# EAGLE design Final_MG (EAGLE 9.3.2)
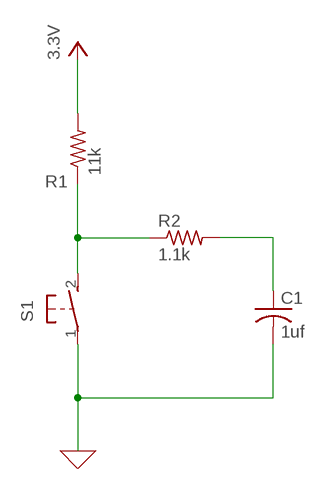
[diagram p0: schematic, sheet 1]

## Parts
C1  1uf  C-US025-024X044  [C025-024X044]
R1  11k  R-US_0204/2V  [0204V]
R2  1.1k  R-US_0204/2V  [0204V]
S1  31-XX  [B3F-31XX]

## Nets
0: C1.2 S1.1(P) ; supply symbol labelled GND
N$1: C1.1 R2.2
N$2: R1.1 R2.1 S1.2(S)
VCC: R1.2 ; supply symbol labelled 3.3V

## Library data of the parts
C1 = rcl:C-US: CAPACITOR, American symbol; SPICEPREFIX: C
R1 R2 = rcl:R-US_: RESISTOR, American symbol; SPICEPREFIX: R
S1 = switch-omron:31-XX: OMRON SWITCH; MPN: B3F-3100; OC_FARNELL: 959704; OC_NEWARK: 36M3582

## Board
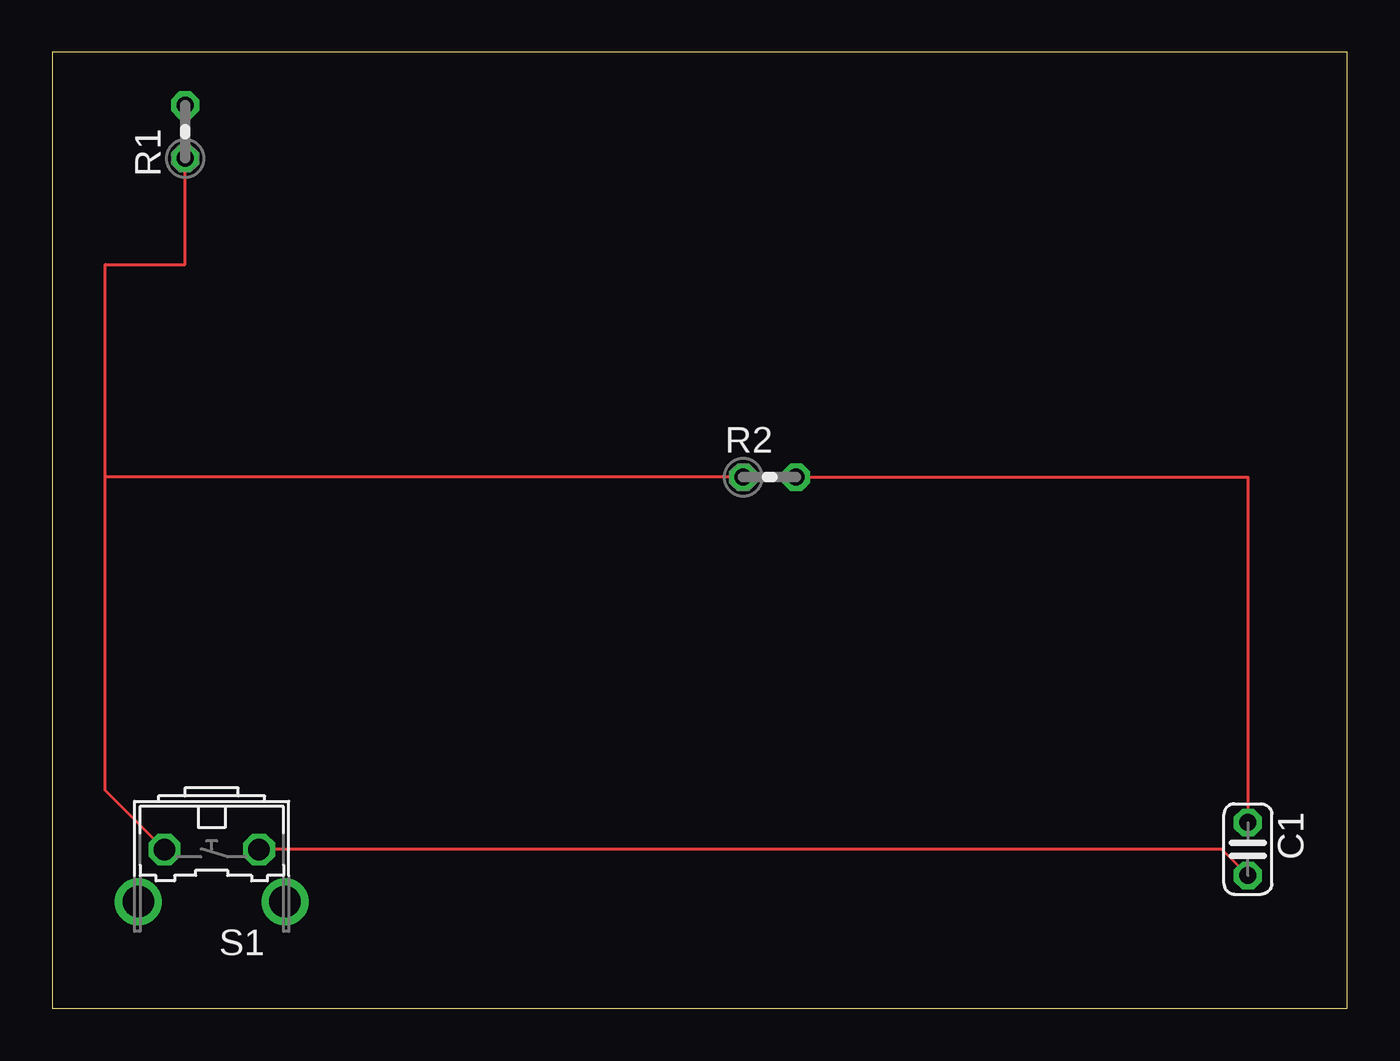
[diagram p1: board, top side]

Size 61.9 x 45.71 mm. Coordinates in mm from the lower left corner, seen from the top.
Outline: 0,0 61.9,0 61.9,45.71 0,45.71 0,0
Copper layers (1*16): Top 0.035mm / dielectric 1.5mm / Bottom 0.035mm
Design rules "default": minimum track width 6mil, minimum drill 0.35mm, track to track 6mil, track to pad 6mil, pad to pad 6mil, via to via 6mil, smd to smd 6mil, copper to edge 40mil, drill to drill 6mil, minimum pad ring 10mil, minimum via ring 8mil, stop-mask expansion 4mil, vias tented up to drill 0mil, thermal gap 10mil

### Footprints (pad centres in the part's own frame; a part is rotated, then mirrored left to right if it is on the bottom)
C025-024X044 = drill 0.813 octagon: 1 -1.27,0; 2 1.27,0
0204V = drill 0.813 octagon: 1 -1.27,0; 2 1.27,0
B3F-31XX = drill 1.016 octagon: 1 -2.261,-1.245; 2 2.261,-1.245 | drill 1.499 pad 2.159: 3 -3.505,1.245; 4 3.505,1.245

### Placement (x,y rotation side)
C1  57.15,7.62 270 top
R1  6.35,41.91 90 top
R2  34.29,25.4 0 top
S1  7.62,6.35 180 top

### Tracks (layer width: path | path; a pad name or v marks a point on that pad's centre or on a via)
0
  Top 0.152: C1.2 55.9,7.6 S1.1
N$1
  Top 0.152: R2.2 57.15,25.4 C1.1
N$2
  Top 0.152: S1.2 2.54,10.41 2.54,25.4 | 2.54,25.4 2.54,35.56 6.35,35.56 R1.1 | R2.1 2.54,25.4